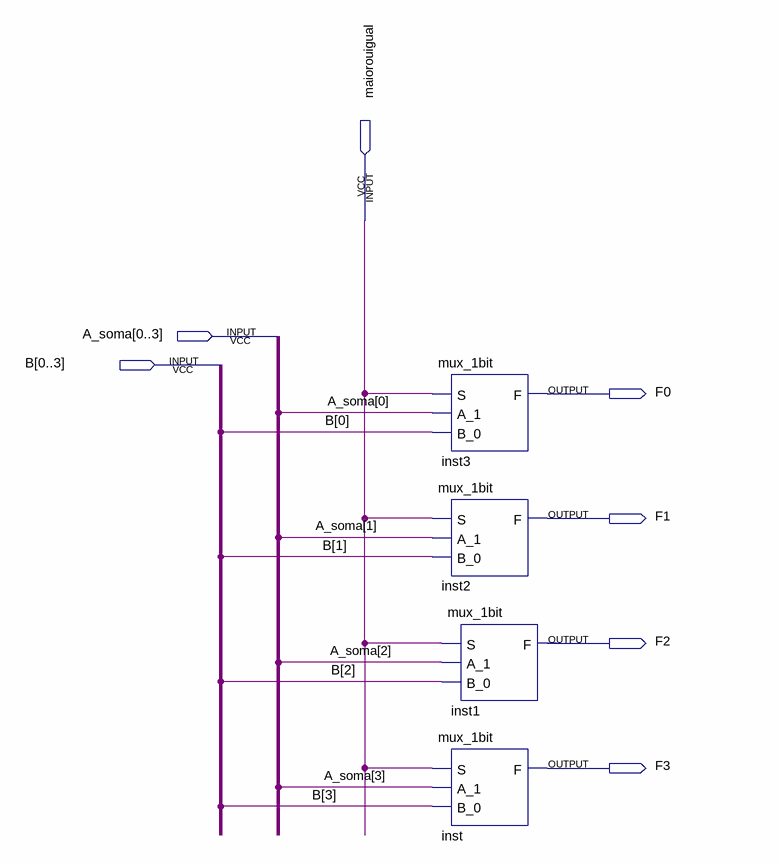
[diagram p0: schematic sheet]
// Quartus schematic MUX_5.bdf as structural Verilog: 4 symbols, 7 pins
module MUX_5 (
  input  maiorouigual,
  input  [0:3] A_soma,
  input  [0:3] B,
  output F0,
  output F1,
  output F2,
  output F3
);

  mux_1bit inst3 (.S(maiorouigual), .A_1(A_soma[0]), .B_0(B[0]), .F(F0));
  mux_1bit inst2 (.S(maiorouigual), .A_1(A_soma[1]), .B_0(B[1]), .F(F1));
  mux_1bit inst1 (.S(maiorouigual), .A_1(A_soma[2]), .B_0(B[2]));  // open: F
  mux_1bit inst (.S(maiorouigual), .A_1(A_soma[3]), .B_0(B[3]), .F(F3));
endmodule
